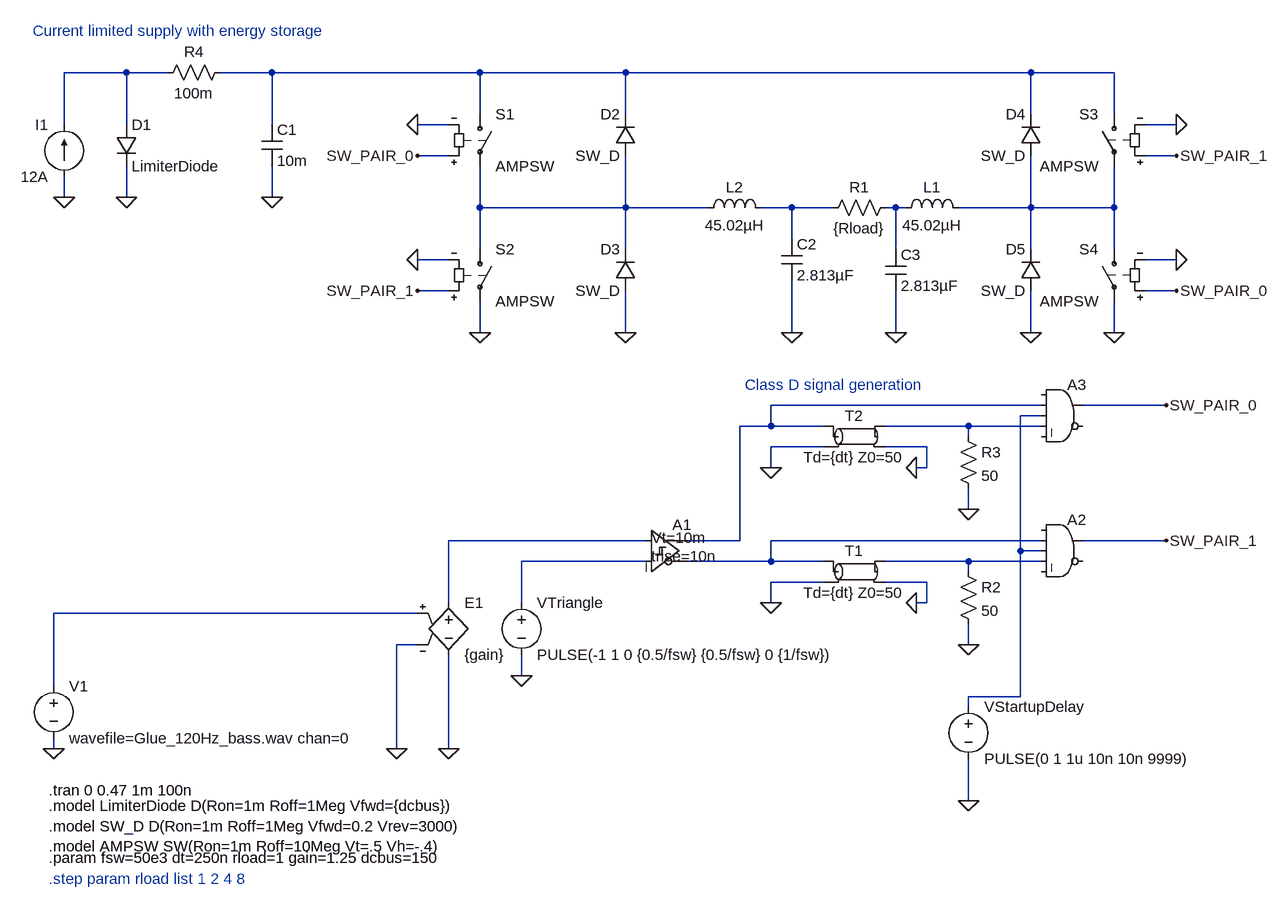
[diagram p0: schematic BassHitAnalysis.asc]
BassHitAnalysis.asc, the LTspice schematic file:
Version 4
SHEET 1 1804 868
WIRE -2336 -480 -2432 -480
WIRE -2272 -480 -2336 -480
WIRE -2112 -480 -2192 -480
WIRE -1792 -480 -2112 -480
WIRE -1568 -480 -1792 -480
WIRE -944 -480 -1568 -480
WIRE -816 -480 -944 -480
WIRE -1792 -416 -1792 -480
WIRE -1568 -416 -1568 -480
WIRE -944 -416 -944 -480
WIRE -816 -416 -816 -480
WIRE -2432 -400 -2432 -480
WIRE -2336 -400 -2336 -480
WIRE -2112 -400 -2112 -480
WIRE -1840 -400 -1888 -400
WIRE -720 -400 -768 -400
WIRE -1840 -352 -1888 -352
WIRE -720 -352 -768 -352
WIRE -2432 -288 -2432 -320
WIRE -2336 -288 -2336 -336
WIRE -2112 -288 -2112 -336
WIRE -1792 -272 -1792 -336
WIRE -1568 -272 -1568 -352
WIRE -1568 -272 -1792 -272
WIRE -1440 -272 -1568 -272
WIRE -1312 -272 -1360 -272
WIRE -1248 -272 -1312 -272
WIRE -1152 -272 -1168 -272
WIRE -1136 -272 -1152 -272
WIRE -944 -272 -944 -352
WIRE -944 -272 -1056 -272
WIRE -816 -272 -816 -336
WIRE -816 -272 -944 -272
WIRE -1312 -224 -1312 -272
WIRE -1792 -208 -1792 -272
WIRE -1568 -208 -1568 -272
WIRE -1152 -208 -1152 -272
WIRE -944 -208 -944 -272
WIRE -816 -208 -816 -272
WIRE -1840 -192 -1888 -192
WIRE -720 -192 -768 -192
WIRE -1840 -144 -1888 -144
WIRE -720 -144 -768 -144
WIRE -1792 -80 -1792 -128
WIRE -1568 -80 -1568 -144
WIRE -1312 -80 -1312 -160
WIRE -1152 -80 -1152 -144
WIRE -944 -80 -944 -144
WIRE -816 -80 -816 -128
WIRE -928 32 -1344 32
WIRE -736 32 -864 32
WIRE -928 48 -960 48
WIRE -1344 64 -1344 32
WIRE -1344 64 -1392 64
WIRE -1264 64 -1344 64
WIRE -1040 64 -1168 64
WIRE -928 64 -1040 64
WIRE -1040 80 -1040 64
WIRE -1264 96 -1344 96
WIRE -1104 96 -1168 96
WIRE -1344 128 -1344 96
WIRE -1104 128 -1104 96
WIRE -1104 128 -1120 128
WIRE -1040 192 -1040 160
WIRE -1536 240 -1840 240
WIRE -1392 240 -1392 64
WIRE -1392 240 -1472 240
WIRE -928 240 -1344 240
WIRE -736 240 -864 240
WIRE -960 256 -960 48
WIRE -928 256 -960 256
WIRE -1536 272 -1728 272
WIRE -1344 272 -1344 240
WIRE -1344 272 -1472 272
WIRE -1264 272 -1344 272
WIRE -1040 272 -1168 272
WIRE -928 272 -1040 272
WIRE -1040 288 -1040 272
WIRE -1264 304 -1344 304
WIRE -1104 304 -1168 304
WIRE -1840 336 -1840 240
WIRE -1728 336 -1728 272
WIRE -1344 336 -1344 304
WIRE -1104 336 -1104 304
WIRE -1104 336 -1120 336
WIRE -1888 352 -2448 352
WIRE -1888 400 -1920 400
WIRE -1040 400 -1040 368
WIRE -1728 448 -1728 416
WIRE -2448 464 -2448 352
WIRE -960 480 -960 256
WIRE -960 480 -1040 480
WIRE -1040 496 -1040 480
WIRE -2448 560 -2448 544
WIRE -1920 560 -1920 400
WIRE -1840 560 -1840 416
WIRE -1040 640 -1040 576
FLAG -2432 -288 0
FLAG -2112 -288 0
FLAG -2336 -288 0
FLAG -2448 560 0
FLAG -1728 448 0
FLAG -1344 336 0
FLAG -1120 336 0
FLAG -1040 400 0
FLAG -1344 128 0
FLAG -1120 128 0
FLAG -1040 192 0
FLAG -736 32 SW_PAIR_0
FLAG -736 240 SW_PAIR_1
FLAG -1888 -400 0
FLAG -1888 -352 SW_PAIR_0
FLAG -1888 -192 0
FLAG -1888 -144 SW_PAIR_1
FLAG -1792 -80 0
FLAG -720 -400 0
FLAG -720 -352 SW_PAIR_1
FLAG -720 -192 0
FLAG -720 -144 SW_PAIR_0
FLAG -816 -80 0
FLAG -1040 640 0
FLAG -1312 -80 0
FLAG -1152 -80 0
FLAG -1568 -80 0
FLAG -944 -80 0
FLAG -1920 560 0
FLAG -1840 560 0
SYMBOL voltage -2448 448 R0
WINDOW 123 0 0 Left 0
WINDOW 39 0 0 Left 0
SYMATTR InstName V1
SYMATTR Value wavefile=Glue_120Hz_bass.wav chan=0
SYMBOL current -2432 -320 R180
WINDOW 0 24 80 Left 2
WINDOW 3 24 0 Left 2
WINDOW 123 0 0 Left 0
WINDOW 39 0 0 Left 0
SYMATTR InstName I1
SYMATTR Value 12A
SYMBOL cap -2128 -400 R0
SYMATTR InstName C1
SYMATTR Value 10m
SYMBOL diode -2352 -400 R0
SYMATTR InstName D1
SYMATTR Value LimiterDiode
SYMBOL Digital\\diffschmitt -1536 192 R0
WINDOW 3 8 44 Left 2
WINDOW 123 8 72 Left 2
SYMATTR Value Vt=10m
SYMATTR Value2 trise=10n
SYMATTR InstName A1
SYMATTR SpiceLine tfall=10n
SYMBOL voltage -1728 320 R0
WINDOW 123 0 0 Left 0
WINDOW 39 0 0 Left 0
SYMATTR InstName VTriangle
SYMATTR Value PULSE(-1 1 0 {0.5/fsw} {0.5/fsw} 0 {1/fsw})
SYMBOL tline -1216 288 R0
SYMATTR InstName T1
SYMATTR Value Td={dt} Z0=50
SYMBOL res -1056 272 R0
SYMATTR InstName R2
SYMATTR Value 50
SYMBOL Digital\\and -896 192 R0
SYMATTR InstName A2
SYMBOL tline -1216 80 R0
SYMATTR InstName T2
SYMATTR Value Td={dt} Z0=50
SYMBOL res -1056 64 R0
SYMATTR InstName R3
SYMATTR Value 50
SYMBOL Digital\\and -896 -16 R0
SYMATTR InstName A3
SYMBOL sw -1792 -432 R0
SYMATTR InstName S1
SYMATTR Value AMPSW
SYMBOL sw -1792 -224 R0
SYMATTR InstName S2
SYMATTR Value AMPSW
SYMBOL sw -816 -432 M0
SYMATTR InstName S3
SYMATTR Value AMPSW
SYMBOL sw -816 -224 M0
SYMATTR InstName S4
SYMATTR Value AMPSW
SYMBOL res -1152 -288 R90
WINDOW 0 0 56 VBottom 2
WINDOW 3 32 56 VTop 2
SYMATTR InstName R1
SYMATTR Value {Rload}
SYMBOL voltage -1040 480 R0
WINDOW 123 0 0 Left 0
WINDOW 39 0 0 Left 0
SYMATTR InstName VStartupDelay
SYMATTR Value PULSE(0 1 1u 10n 10n 9999)
SYMBOL ind -1152 -256 R270
WINDOW 0 32 56 VTop 2
WINDOW 3 5 56 VBottom 2
SYMATTR InstName L1
SYMATTR Value 45.02µH
SYMBOL ind -1456 -256 R270
WINDOW 0 32 56 VTop 2
WINDOW 3 5 56 VBottom 2
SYMATTR InstName L2
SYMATTR Value 45.02µH
SYMBOL cap -1328 -224 R0
SYMATTR InstName C2
SYMATTR Value 2.813µF
SYMBOL cap -1168 -208 R0
SYMATTR InstName C3
SYMATTR Value 2.813µF
SYMBOL diode -1552 -352 R180
WINDOW 0 24 64 Left 2
WINDOW 3 24 0 Left 2
SYMATTR InstName D2
SYMATTR Value SW_D
SYMBOL diode -1552 -144 R180
WINDOW 0 24 64 Left 2
WINDOW 3 24 0 Left 2
SYMATTR InstName D3
SYMATTR Value SW_D
SYMBOL diode -928 -352 R180
WINDOW 0 24 64 Left 2
WINDOW 3 24 0 Left 2
SYMATTR InstName D4
SYMATTR Value SW_D
SYMBOL diode -928 -144 R180
WINDOW 0 24 64 Left 2
WINDOW 3 24 0 Left 2
SYMATTR InstName D5
SYMATTR Value SW_D
SYMBOL e -1840 320 R0
SYMATTR InstName E1
SYMATTR Value {gain}
SYMBOL res -2176 -496 R90
WINDOW 0 0 56 VBottom 2
WINDOW 3 32 56 VTop 2
SYMATTR InstName R4
SYMATTR Value 100m
TEXT -2456 624 Left 2 !.tran 0 0.47 1m 100n
TEXT -2456 648 Left 2 !.model LimiterDiode D(Ron=1m Roff=1Meg Vfwd={dcbus})\n.model SW_D D(Ron=1m Roff=1Meg Vfwd=0.2 Vrev=3000)\n.model AMPSW SW(Ron=1m Roff=10Meg Vt=.5 Vh=-.4)
TEXT -2480 -544 Left 2 ;Current limited supply with energy storage
TEXT -2456 728 Left 2 !.param fsw=50e3 dt=250n rload=1 gain=1.25 dcbus=150
TEXT -1384 0 Left 2 ;Class D signal generation
TEXT -2456 760 Left 2 ;.step param rload list 1 2 4 8

The netlist it stands for:
* BassHitAnalysis.asc
V1 N014 0 wavefile=Glue_120Hz_bass.wav chan=0
I1 0 N001 12A
C1 N002 0 10m
D1 N001 0 LimiterDiode
A1 N010 N012 0 0 0 N011 N007 0 SCHMITT Vt=10m trise=10n tfall=10n
VTriangle N012 0 PULSE(-1 1 0 {0.5/fsw} {0.5/fsw} 0 {1/fsw})
T1 N011 0 N013 0 Td={dt} Z0=50
R2 N013 0 50
A2 0 N011 N008 N013 0 0 SW_PAIR_1 0 AND
T2 N007 0 N009 0 Td={dt} Z0=50
R3 N009 0 50
A3 0 N007 N008 N009 0 0 SW_PAIR_0 0 AND
S1 N002 N003 SW_PAIR_0 0 AMPSW
S2 N003 0 SW_PAIR_1 0 AMPSW
S3 N002 N006 SW_PAIR_1 0 AMPSW
S4 N006 0 SW_PAIR_0 0 AMPSW
R1 N005 N004 {Rload}
VStartupDelay N008 0 PULSE(0 1 1u 10n 10n 9999)
L1 N005 N006 45.02µH
L2 N003 N004 45.02µH
C2 N004 0 2.813µF
C3 N005 0 2.813µF
D2 N003 N002 SW_D
D3 0 N003 SW_D
D4 N006 N002 SW_D
D5 0 N006 SW_D
E1 N010 0 N014 0 {gain}
R4 N002 N001 100m
.model D D
.lib standard.dio
.tran 0 0.47 1m 100n
.model LimiterDiode D(Ron=1m Roff=1Meg Vfwd={dcbus})
.model SW_D D(Ron=1m Roff=1Meg Vfwd=0.2 Vrev=3000)
.model AMPSW SW(Ron=1m Roff=10Meg Vt=.5 Vh=-.4)
* Current limited supply with energy storage
.param fsw=50e3 dt=250n rload=1 gain=1.25 dcbus=150
* Class D signal generation
* .step param rload list 1 2 4 8
.backanno
.end